# EAGLE design Qwiic_PIR (EAGLE 9.6.0)
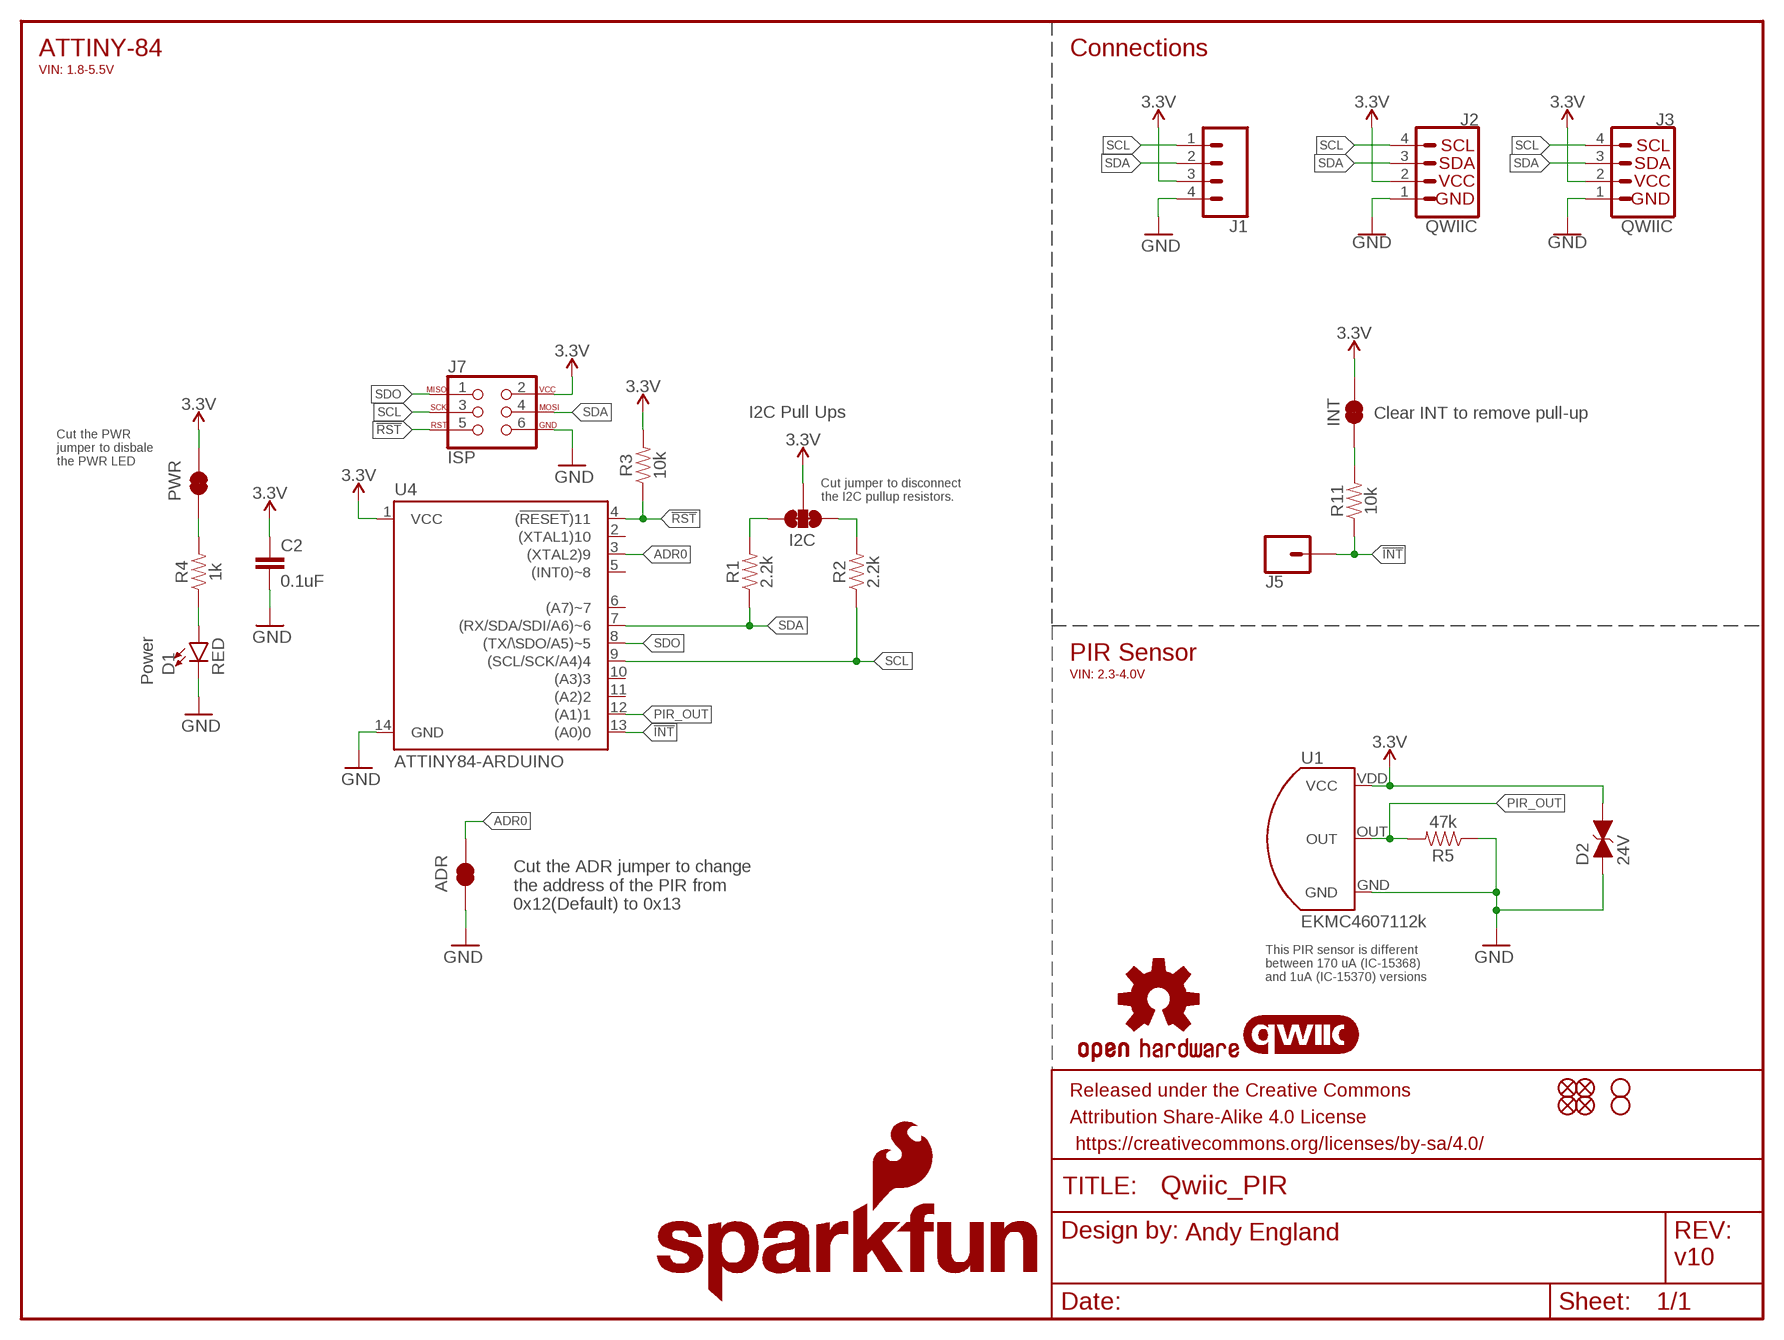
[diagram p0: schematic, sheet 1]

## Parts
ADR  JUMPER-SMT_2_NC_TRACE_SILK  [SMT-JUMPER_2_NC_TRACE_SILK]
C2  0.1uF  0.1UF-0603-25V-(+80/-20%)  [0603]
D1  RED  LED-RED0603  [LED-0603]
D2  24V  DIODE_TVS  [0603]
FRAME1  FRAME-LETTER  [CREATIVE_COMMONS]
H1  STAND-OFF  [STAND-OFF]
H2  STAND-OFF  [STAND-OFF]
I2C  JUMPER-SMT_3_2-NC_TRACE_SILK  [SMT-JUMPER_3_2-NC_TRACE_SILK]
INT  JUMPER-SMT_2_NC_TRACE_SILK  [SMT-JUMPER_2_NC_TRACE_SILK]
J1  CONN_041X04_NO_SILK  [1X04_NO_SILK]
J2  QWIIC  QWIIC_CONNECTORJS-1MM  [JST04_1MM_RA]
J3  QWIIC  QWIIC_CONNECTORJS-1MM  [JST04_1MM_RA]
J5  CONN_01PTH_NO_SILK_YES_STOP  [1X01_NO_SILK]
J7  ISP  AVR_SPI_PROG_3X2TESTPOINTS  [2X3_TEST_POINTS]
JP2  FIDUCIALUFIDUCIAL  [MICRO-FIDUCIAL]
JP6  FIDUCIALUFIDUCIAL  [MICRO-FIDUCIAL]
JP8  FIDUCIALUFIDUCIAL  [MICRO-FIDUCIAL]
JP9  FIDUCIALUFIDUCIAL  [MICRO-FIDUCIAL]
LOGO1  OSHW-LOGOMINI  [OSHW-LOGO-MINI]
LOGO2  QWIIC_LOGO_5MM  [QWIIC_5MM]
LOGO3  SFE_LOGO_NAME.1_INCH  [SFE_LOGO_NAME_.1]
LOGO4  SFE_LOGO_FLAME.1_INCH  [SFE_LOGO_FLAME_.1]
PWR  JUMPER-SMT_2_NC_TRACE_SILK  [SMT-JUMPER_2_NC_TRACE_SILK]
R1  2.2k  2.2KOHM-0603-1/10W-1%  [0603]
R2  2.2k  2.2KOHM-0603-1/10W-1%  [0603]
R3  10k  10KOHM-0603-1/10W-1%  [0603]
R4  1k  1KOHM-0603-1/10W-1%  [0603]
R5  47k  47KOHM-0603-1/10W-1%  [0603]
R11  10k  10KOHM-0603-1/10W-1%  [0603]
U1  EKMC4607112k  PIR_EKM4607112K  [TO-3]
U4  ATTINY84-ARDUINO  [SO14]

## Nets
3.3V: C2.1 D2.2(C) I2C.2 INT.2 J1.3 J2.2 J3.2 J7.2 PWR.2 R3.2 U1.VDD(VCC) U4.1(VCC)
!INT: J5.1 R11.1 U4.13((A0)0)
!RST: J7.5 R3.1 U4.4((!RESET!)11)
ADR0: ADR.2 U4.3((XTAL2)9)
GND: ADR.1 C2.2 D1.C D2.1(A) J1.4 J2.1 J3.1 J7.6 R5.1 U1.GND U4.14(GND)
INT_R: INT.1 R11.2
N$3: D1.A R4.1
PIR_OUT: R5.2 U1.OUT U4.12((A1)1)
SCL: J1.1 J2.4 J3.4 J7.3 R2.1 U4.9((SCL/SCK/A4)4)
SCL_PU1: I2C.1 R2.2
SDA: J1.2 J2.3 J3.3 J7.4 R1.1 U4.7((RX/SDA/SDI/A6)~6)
SDA_PU1: I2C.3 R1.2
SDO: J7.1 U4.8((TX/\SDO/A5)~5)
STAT: PWR.1 R4.2
Unconnected: U4.2((XTAL1)10) U4.5((INT0)~8) U4.6((A7)~7) U4.10((A3)3) U4.11((A2)2)

## Notes on the sheet
- ATTINY-84 | Connections
- VIN: 1.8-5.5V
- I2C Pull Ups | Clear INT to remove pull-up
- Cut the PWR
  jumper to disbale
  the PWR LED
- Cut jumper to disconnect
  the I2C pullup resistors.
- PIR Sensor
- VIN: 2.3-4.0V
- Power
- Cut the ADR jumper to change 
  the address of the PIR from 
  0x12(Default) to 0x13
- This PIR sensor is different 
  between 170 uA (IC-15368)
  and 1uA (IC-15370) versions
- Andy England
- v10

## Library data of the parts
ADR INT PWR = SparkFun-Jumpers:JUMPER-SMT_2_NC_TRACE: Normally closed trace jumper This jumper has a trace between two pads so it's normally closed (NC). Use a razor knife to open the connection. For best results follow the IPC guidelines for cutting traces: Cutout at least 0.063 mm (0.005 in). Remove all loose material to clean up the cut area. Seal the cut with an approved epoxy. Reapply solder to reclose the connection.
C2 = SparkFun-Capacitors:0.1UF: 0.1µF ceramic capacitors A capacitor is a passive two-terminal electrical component used to store electrical energy temporarily in an electric field.; PROD_ID: CAP-00810
D1 = SparkFun-LED:LED-RED: Red SMD LED Used in manufacturing of most products at SparkFun Packages: 0603 - SMD 0603 package [Product Link] <http://docs.avagotech.com/docs/AV02-0551EN> 0603 SMART - SMD 0603 SMART package ( more efficient and expensive)[Product Link] <http://www.osram-os.com/Graphics/XPic2/00077099_0.pdf> 1206 - SMD1206 package [Product Link] <https://www.sparkfun.com/datasheets/DevTools/LilyPad/Q150OVS4.pdff> SparkFun Products: Pro Mini 328 -5V <https://www.sparkfun.com/products/821> RedBoard <https://www.sparkfun.com/products/12757> IOIO-OTG <https://www.sparkfun.com/products/13613>; PROD_ID: DIO-00819
D2 = SparkFun-DiscreteSemi:DIODE_TVS; PROD_ID: DIO-14502
FRAME1 = SparkFun-Aesthetics:FRAME-LETTER: Schematic Frame - Letter Standard 8.5x11 US Letter frame
H1 H2 = SparkFun-Hardware:STAND-OFF: Stand Off Drill holes for mechanically mounting via screws, standoffs, etc. Note: Use the keepout ring to avoid running the screw head into surrounding components. Variant Overviews STAND-OFF - Mechanical footprint for a #4 phillips button head screw. STAND-OFF-TIGHT - Mechanical footprint for a #4 phillips button head screw, Example SparkFun Products Screw - Phillips Head (1/4", 4-40, 10 pack) <https://www.sparkfun.com/products/10453> (PRT-10453) Screw - Phillips Head (1/2", 4-40, 10 pack) <https://www.sparkfun.com/products/10452> (PRT-10452) Screw - Phillips Head (3/4", 4-40, 10 pack) <https://www.sparkfun.com/products/10451> (PRT-10451) Screw - Phillips Head (1", 4-40, 10 pack) <https://www.sparkfun.com/products/10450> (PRT-10450)
I2C = SparkFun-Jumpers:JUMPER-SMT_3_2-NC_TRACE: Normally closed trace jumper (2 of 2 connections) This jumper has a trace between all three pads so they are normally closed (NC). Use a razor knife to open the connection(s). For best results follow the IPC guidelines for cutting traces: Cutout at least 0.063 mm (0.005 in). Remove all loose material to clean up the cut area. Seal the cut with an approved epoxy. Reapply solder to reclose the connection(s).
J1 = SparkFun-Connectors:CONN_04: Multi connection point. Often used as Generic Header-pin footprint for 0.1 inch spaced/style header connections On any of the 0.1 inch spaced packages, you can populate with these: Break Away Headers - Straight <https://www.sparkfun.com/products/116> (PRT-00116) Break Away Male Headers - Right Angle <https://www.sparkfun.com/products/553> (PRT-00553) Female Headers <https://www.sparkfun.com/products/115> (PRT-00115) Break Away Headers - Machine Pin <https://www.sparkfun.com/products/117> (PRT-00117) Break Away Female Headers - Swiss Machine Pin <https://www.sparkfun.com/products/743> (PRT-00743) For SCREWTERMINALS and SPRING TERMINALS visit here: Screw Terimnals on SparkFun.com <https://www.sparkfun.com/search/results?term=Screw+Terminals> (5mm/3.5mm/2.54mm spacing) This device is also useful as a general connection point to wire up your design to another part of your project. Our various solder wires solder well into these plated through hole pads. Hook-Up Wire - Assortment (Stranded, 22 AWG) <https://www.sparkfun.com/products/11375> (PRT-11375) Hook-Up Wire - Assortment (Solid Core, 22 AWG) <https://www.sparkfun.com/products/11367> (PRT-11367) View the entire wire category on our website here <https://www.sparkfun.com/categories/141> Special notes: Molex polarized connector foot print use with SKU : PRT-08231 with associated crimp pins and housings. 1MM SMD Version SKU: PRT-10208; PROD_ID: CONN-09696
J2 J3 = SparkFun-Connectors:QWIIC_CONNECTOR: SparkFun I2C Standard Qwiic Connector An SMD 1mm pitch JST connector makes it easy and quick (get it? Qwiic?) to connect I2C devices to each other. The Qwiic system <http://www.sparkfun.com/qwiic> enables fast and solderless connection between popular platforms and various sensors and actuators. We carry 200mm <https://www.sparkfun.com/products/14204>, 100mm <https://www.sparkfun.com/products/14205>, 50mm <https://www.sparkfun.com/products/14206>, and breadboard friendly <https://www.sparkfun.com/products/14207> Qwiic cables. We also offer 10 pcs strips <https://www.sparkfun.com/products/14323> the SMD connectors.; PROD_ID: CONN-13694; VALUE: QWIIC_RIGHT_ANGLE
J5 = SparkFun-Connectors:CONN_01: Single connection point. Often used as Generic Header-pin footprint for 0.1 inch spaced/style header connections On any of the 0.1 inch spaced packages, you can populate with these: Break Away Headers - Straight <https://www.sparkfun.com/products/116> (PRT-00116) Break Away Male Headers - Right Angle <https://www.sparkfun.com/products/553> (PRT-00553) Female Headers <https://www.sparkfun.com/products/115> (PRT-00115) Break Away Headers - Machine Pin <https://www.sparkfun.com/products/117> (PRT-00117) Break Away Female Headers - Swiss Machine Pin <https://www.sparkfun.com/products/743> (PRT-00743) This device is also useful as a general connection point to wire up your design to another part of your project. Our various solder wires solder well into these plated through hole pads. Hook-Up Wire - Assortment (Stranded, 22 AWG) <https://www.sparkfun.com/products/11375> (PRT-11375) Hook-Up Wire - Assortment (Solid Core, 22 AWG) <https://www.sparkfun.com/products/11367> (PRT-11367) View the entire wire category on our website here <https://www.sparkfun.com/categories/141> Special notes: SMTSO-256-ET is a "flush mount" nut for a 4-40 screw. We mostly use this on specialty testbeds; it is a nice way to connect hardware to your PCB at an adjustable hieght. Also note, the SNAP packages are for using a snappable style connector. We sell a baggie of snaps and they are also used on two LilyPad designs: Snap Assortment - 30 pack (male and female) <https://www.sparkfun.com/products/11347> (DEV-11347) LilyPad Arduino SimpleSnap <https://www.sparkfun.com/products/10941> (DEV-10941) LilyPad SimpleSnap Protoboard <https://www.sparkfun.com/products/10940> (DEV-10940)
J7 = SparkFun-Connectors:AVR_SPI_PROG_3X2: AVR ISP 6 Pin This is the reduced ISP connector for AVR programming. Common on Arduino. This footprint will take up less PCB space and can be used with a 10-pin to 6-pin adapter such as SKU: BOB-08508 **Special note about "TEST_POINT" package. The stop mask is on the top side, so if you want your programming test points to be on the bottom of your board, make sure to place this package on the bottom side of the board. This also ensure that the orientation to program from the bottom side will be correct. SparkFun Products: SparkFun ISP Pogo Adapter <https://www.sparkfun.com/products/11591> - NS Tiny AVR Programmer <https://www.sparkfun.com/products/11801> -PTH
JP2 JP6 JP8 JP9 = SparkFun:FIDUCIAL: Fiducial Alignment Points Various fiducial points for machine vision alignment.
LOGO1 = SparkFun-Aesthetics:OSHW-LOGO: Open-Source Hardware (OSHW) Logo This logo indicates the piece of hardware it is found on incorporates a OSHW license and/or adheres to the definition of open source hardware found here: http://freedomdefined.org/OSHW
LOGO2 = SparkFun-Aesthetics:QWIIC_LOGO: Qwiic Logos for placement on schematic and PCB. The 5.5mm silk logo is best for placing next to Qwiic connector.
LOGO3 = SparkFun-Aesthetics:SFE_LOGO_NAME: SparkFun Font Logo This is the SparkFun name logo. The logo on the schematic will always be the same size; the package variant is the height of the flame part of the logo (or the height the flame would be, if it were drawn). Default layer for the logo on the board is tSilk.
LOGO4 = SparkFun-Aesthetics:SFE_LOGO_FLAME: SparkFun Flame Logo This is the SparkFun flame logo. The logo on the schematic will always be the same size; the package variant is the height of the flame. Default layer for the logo on the board is tSilk.
R1 R2 = SparkFun-Resistors:2.2KOHM: 2.2kΩ resistor A resistor is a passive two-terminal electrical component that implements electrical resistance as a circuit element. Resistors act to reduce current flow, and, at the same time, act to lower voltage levels within circuits. - Wikipedia; PROD_ID: RES-08272
R3 R11 = SparkFun-Resistors:10KOHM: 10kΩ resistor A resistor is a passive two-terminal electrical component that implements electrical resistance as a circuit element. Resistors act to reduce current flow, and, at the same time, act to lower voltage levels within circuits. - Wikipedia; PROD_ID: RES-00824
R4 = SparkFun-Resistors:1KOHM: 1kΩ resistor A resistor is a passive two-terminal electrical component that implements electrical resistance as a circuit element. Resistors act to reduce current flow, and, at the same time, act to lower voltage levels within circuits. - Wikipedia; PROD_ID: RES-07856
R5 = SparkFun-Resistors:47KOHM: 47kΩ resistor A resistor is a passive two-terminal electrical component that implements electrical resistance as a circuit element. Resistors act to reduce current flow, and, at the same time, act to lower voltage levels within circuits. - Wikipedia; PROD_ID: RES-07871
U1 = SparkFun-Sensors:PIR_EKM: Panasonic EKMCX607112 PIR Sensor The low-power series of PIR sensors from Panasonic come in a 170 uA (4607) and 1 uA (1607) version.; PROD_ID: IC-15368
U4 = SparkFun-IC-Microcontroller:ATTINY84-ARDUINO; PROD_ID: IC-14155

## Board
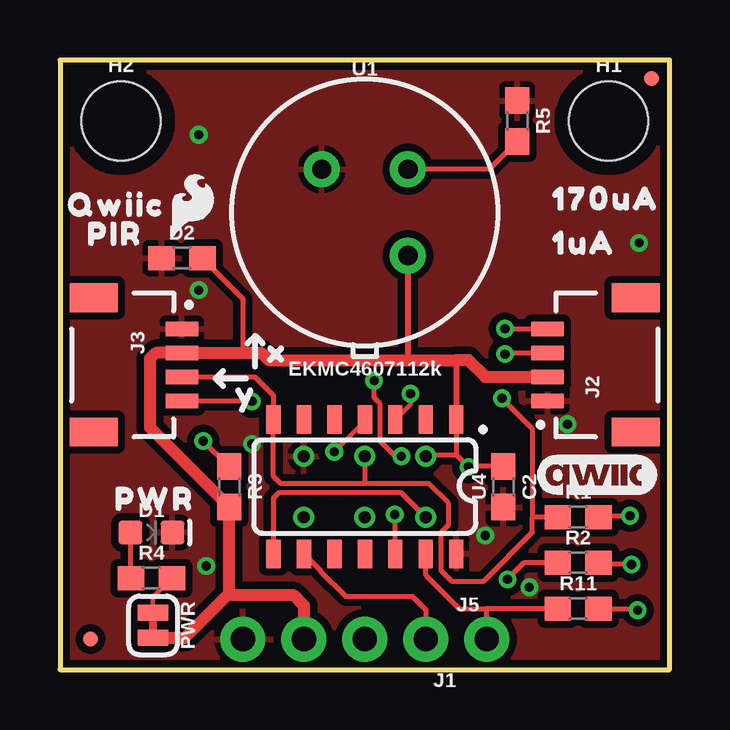
[diagram p1: board, top side]
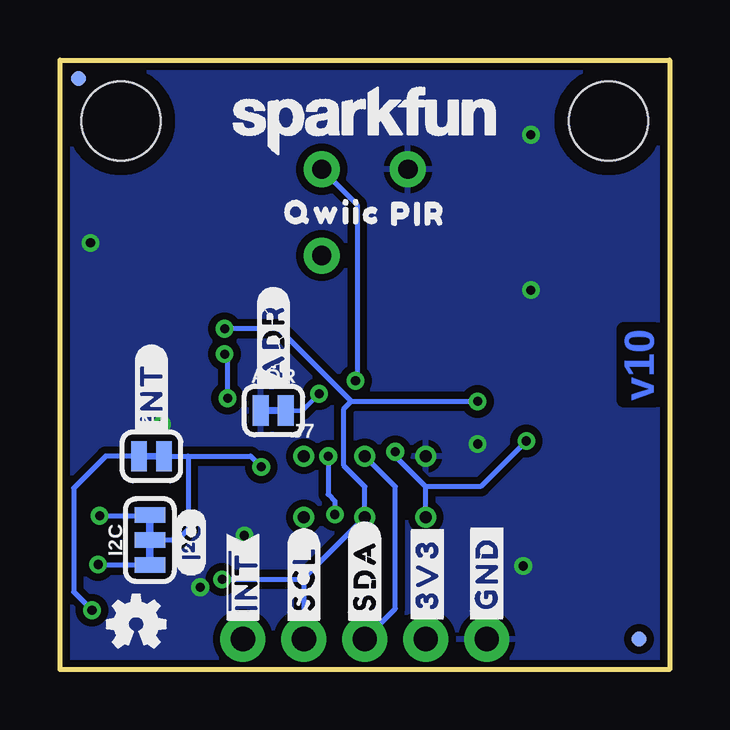
[diagram p2: board, bottom side, seen from below]

Size 25.4 x 25.4 mm. Coordinates in mm from the lower left corner, seen from the top.
Outline: 0,0 25.4,0 25.4,25.4 0,25.4 0,0
Copper layers (1*16): Top 0.035mm / dielectric 1.5mm / Bottom 0.035mm
Design rules "SparkFun-2-layer-TIGHT": minimum track width 7mil, minimum drill 15mil, track to track 7mil, track to pad 7mil, pad to pad 7mil, via to via 7mil, smd to smd 7mil, copper to edge 7mil, drill to drill 7mil, minimum pad ring 7mil, minimum via ring 7mil, stop-mask expansion 4mil, vias tented up to drill 25mil, thermal gap 10mil

### Footprints (pad centres in the part's own frame; a part is rotated, then mirrored left to right if it is on the bottom)
SMT-JUMPER_2_NC_TRACE_SILK = smd 0.66 x 1.27: 1 -0.521,0; 2 0.521,0
0603 = smd 1.1 x 1: 1 -0.85,0; 2 0.85,0
LED-0603 = smd 1 x 1: A -0.877,0; C 0.877,0
STAND-OFF = hole 3.302: 0,0
SMT-JUMPER_3_2-NC_TRACE_SILK = smd 0.66 x 1.27: 1 -1.041,0; 2 0,0; 3 1.041,0
1X04_NO_SILK = drill 1.016 pad 1.88: 1 0,0; 2 2.54,0; 3 5.08,0; 4 7.62,0
JST04_1MM_RA = smd 0.6 x 1.35: 1 -1.5,0; 2 -0.5,0; 3 0.5,0; 4 1.5,0 | smd 1.2 x 2: NC1 2.8,-3.675; NC2 -2.8,-3.675
1X01_NO_SILK = drill 1.016 pad 1.88: 1 0,0
2X3_TEST_POINTS = drill 0.508: 1 -2.54,-1.27; 2 -2.54,1.27; 3 0,-1.27; 4 0,1.27; 5 2.54,-1.27; 6 2.54,1.27
MICRO-FIDUCIAL = smd 0.635 x 0.635: 1 0,0
TO-3 = drill 0.8 pad 1.5: GND -1.796,1.796; OUT 1.796,1.796; VDD 1.796,-1.796
SO14 = smd 0.6 x 1.2: 1 -3.81,-2.8; 2 -2.54,-2.8; 3 -1.27,-2.8; 4 0,-2.8; 5 1.27,-2.8; 6 2.54,-2.8; 7 3.81,-2.8; 8 3.81,2.8; 9 2.54,2.8; 10 1.27,2.8; 11 0,2.8; 12 -1.27,2.8; 13 -2.54,2.8; 14 -3.81,2.8

### Placement (x,y rotation side)
ADR  16.51,10.79 0 bottom
C2  18.48,7.62 270 top
D1  3.81,5.71 0 top
D2  5.08,17.14 0 top
FRAME1  -19.05,-8.89 0 top  (outside the outline)
H1  22.86,22.86 0 top
H2  2.54,22.86 0 top
I2C  21.65,5.4 90 bottom
INT  21.59,8.89 0 bottom
J1  15.24,1.27 180 top
J2  20.32,12.7 90 top
J3  5.08,12.7 270 top
J5  17.78,1.27 0 top
J7  12.7,7.62 0 bottom
JP2  24.64,24.64 0 bottom
JP6  1.27,1.27 0 bottom
JP8  1.27,1.27 0 top
JP9  24.64,24.64 0 top
LOGO1  22.23,1.91 0 bottom
LOGO2  22.35,8.13 0 top
LOGO3  12.7,22.86 0 bottom
LOGO4  5.52,19.37 0 top
PWR  3.87,1.84 270 top
R1  21.59,6.35 0 top
R2  21.59,4.45 0 top
R3  7.05,7.62 270 top
R4  3.81,3.81 0 top
R5  19.05,22.86 270 top
R11  21.59,2.54 0 top
U1  12.7,19.05 0 top
U4  12.7,7.62 180 top
U$1  [PIR0]  0.44,18.16 0 top
U$2  [170UA0]  19.81,19.62 0 top
U$3  [PWR0]  1.59,7.11 0 top
U$4  [#INT#0]  21.59,9.59 90 bottom
U$5  [#3V3#0]  10.1,1.78 90 bottom
U$6  [#SDA#0]  12.7,1.71 90 bottom
U$7  [#SCL#0]  15.24,1.71 90 bottom
U$8  [##INT##0]  17.78,1.71 90 bottom
U$9  [1UA0]  19.81,17.78 0 top
U$10  [I_SUPER2_C-()-03]  19.94,3.87 90 bottom
U$11  [#ADR#0]  16.51,11.43 90 bottom
U$13  [PIR0]  12.32,18.99 0 bottom
U$14  [X0]  7.94,13.27 0 top
U$16  [Y0]  6.6,11.49 0 top
U$17  [QWIIC0]  -0.38,19.37 0 top
U$18  [QWIIC0]  16.76,19.05 0 bottom
U$19  [#GND#0]  7.62,1.78 90 bottom

### Tracks (layer width: path | path; a pad name or v marks a point on that pad's centre or on a via)
3.3V  (via drill 0.38)
  Top 0.178: 6.99,3.11 7.05,3.11 | 7.05,6.79 R3.2
  Top 0.203: U4.1 16.51,8.95 | 16.51,8.95 v17.02,8.45 17.04,8.47 C2.1 | D2.2 7.62,15.46 7.62,13.2 | J7.2 15.3,8.95 16.51,8.95
  Top 0.254: U1.VDD 14.5,12.9 | 16.51,12.9 U4.1
  Top 0.508: PWR.2 5.2,1.32 6.99,3.11 | J2.2 17.72,12.2 17.02,12.9 16.51,12.9 14.5,12.9 8.69,12.9 8.39,13.2 7.62,13.2 J3.2 3.99,13.2 3.75,12.95 3.75,10.1 7.05,6.79 | J1.3 10.16,2.67 9.72,3.11 7.05,3.11 R3.2
  Bottom 0.203: 20.07,8.89 17.46,8.89 v17.02,8.45 | 20.07,8.89 20.07,5.84 20.51,5.4 I2C.2 | INT.2 20.07,8.89
!INT
  Top 0.203: J5.1 17.78,2.54 | U4.13 15.24,3.94 16.64,2.54 17.78,2.54 | R11.1 17.78,2.54
!RST  (via drill 0.38)
  Top 0.178: v11.43,9.08 12.7,10.35 U4.4
  Top 0.203: R3.1 7.02,8.47 v5.97,9.53
  Bottom 0.203: 10.16,7.62 7.87,7.62 v5.97,9.53 | 10.16,7.62 11.43,8.89 v11.43,9.08 | J7.5 10.16,7.62
ADR0  (via drill 0.38)
  Top 0.178: U4.3 14.61,11.05 v14.61,11.49
  Bottom 0.178: v14.61,11.49 15.3,10.79 ADR.2
GND  (via drill 0.38)
  other vias: 21.15,10.22 17.72,5.59 5.78,22.29 5.78,15.81 19.56,3.43 6.1,4.32 24.13,17.78 8,9.4
  pour Top (isolate 0.305): 0,0 0,25.4 25.4,25.4 25.4,0
  pour Bottom (isolate 0.305): 0,0 25.4,0 25.4,25.4 0,25.4
INT_R  (via drill 0.38)
  Top 0.203: R11.2 24,2.54 v24.07,2.48
  Bottom 0.203: v24.07,2.48 24.83,3.24 24.83,7.56 23.5,8.89 INT.1
N$3
  Top 0.203: D1.A 2.93,3.84 R4.1
PIR_OUT  (via drill 0.38)
  Top 0.203: U4.12 13.97,6.46 v13.95,6.46 | v14.22,8.89 13.97,8.89 13.34,9.52 13.34,11.07 13.09,11.33 v13.09,12.04 | R5.2 17.89,20.85 U1.OUT | v13.09,12.04
  Bottom 0.203: v14.22,8.89 14.22,7.3 13.95,7.03 v13.95,6.46 | v13.09,12.04 13.02,12.1 13.02,19.37 U1.OUT
SCL  (via drill 0.38)
  Top 0.203: v18.54,14.2 J2.4 | U4.9 10.85,4.13 10.85,4.1 11.9,3.05 14.68,3.05 15.24,2.5 J1.1 | J3.4 7.98,11.2 v8,11.18 | R2.1 19.33,4.45 v18.64,3.76
  Bottom 0.203: 15.24,3.75 15.24,3.81 J7.3 12.7,7.62 13.58,8.5 13.58,10.87 13.27,11.18 | 15.24,3.75 J1.1 | 13.27,11.18 v8,11.18 | v18.54,14.2 16.3,14.2 13.27,11.18 | 15.24,3.75 15.25,3.76 v18.64,3.76
SCL_PU1  (via drill 0.38)
  Top 0.203: v23.81,4.38 22.5,4.38 R2.2
  Bottom 0.203: v23.81,4.38 23.79,4.36 I2C.1
SDA  (via drill 0.38)
  Top 0.203: 12.7,7.75 15.37,7.75 16.19,6.92 16.19,6.03 15.88,5.71 15.88,4.13 16.32,3.68 17.65,3.68 19.68,5.71 19.68,6.35 | 12.7,7.75 9.21,7.75 8.89,8.06 U4.7 8.89,11.43 8.12,12.2 J3.3 | R1.1 19.68,6.35 | v18.41,11.3 19.68,10.03 19.68,6.35 | v18.54,13.14 18.6,13.2 J2.3 | J7.4 12.7,7.75
  Bottom 0.203: v18.41,11.3 18.41,13.02 v18.54,13.14 | J1.2 11.43,2.54 11.43,7.62 J7.4
SDA_PU1  (via drill 0.38)
  Top 0.203: R1.2 22.5,6.41 v23.75,6.41
  Bottom 0.203: v23.75,6.41 21.68,6.41 I2C.3
SDO
  Top 0.203: U4.8 8.89,7.15 9.11,7.37 14.22,7.37 J7.1
STAT
  Top 0.178: R4.2 3.87,3.02 PWR.1

### Text on the board
Bottom: v10
Measures: Units in Inches
tDocu: Andy England